# EAGLE schematic top_3-28-21m (EAGLE 9.6.1)
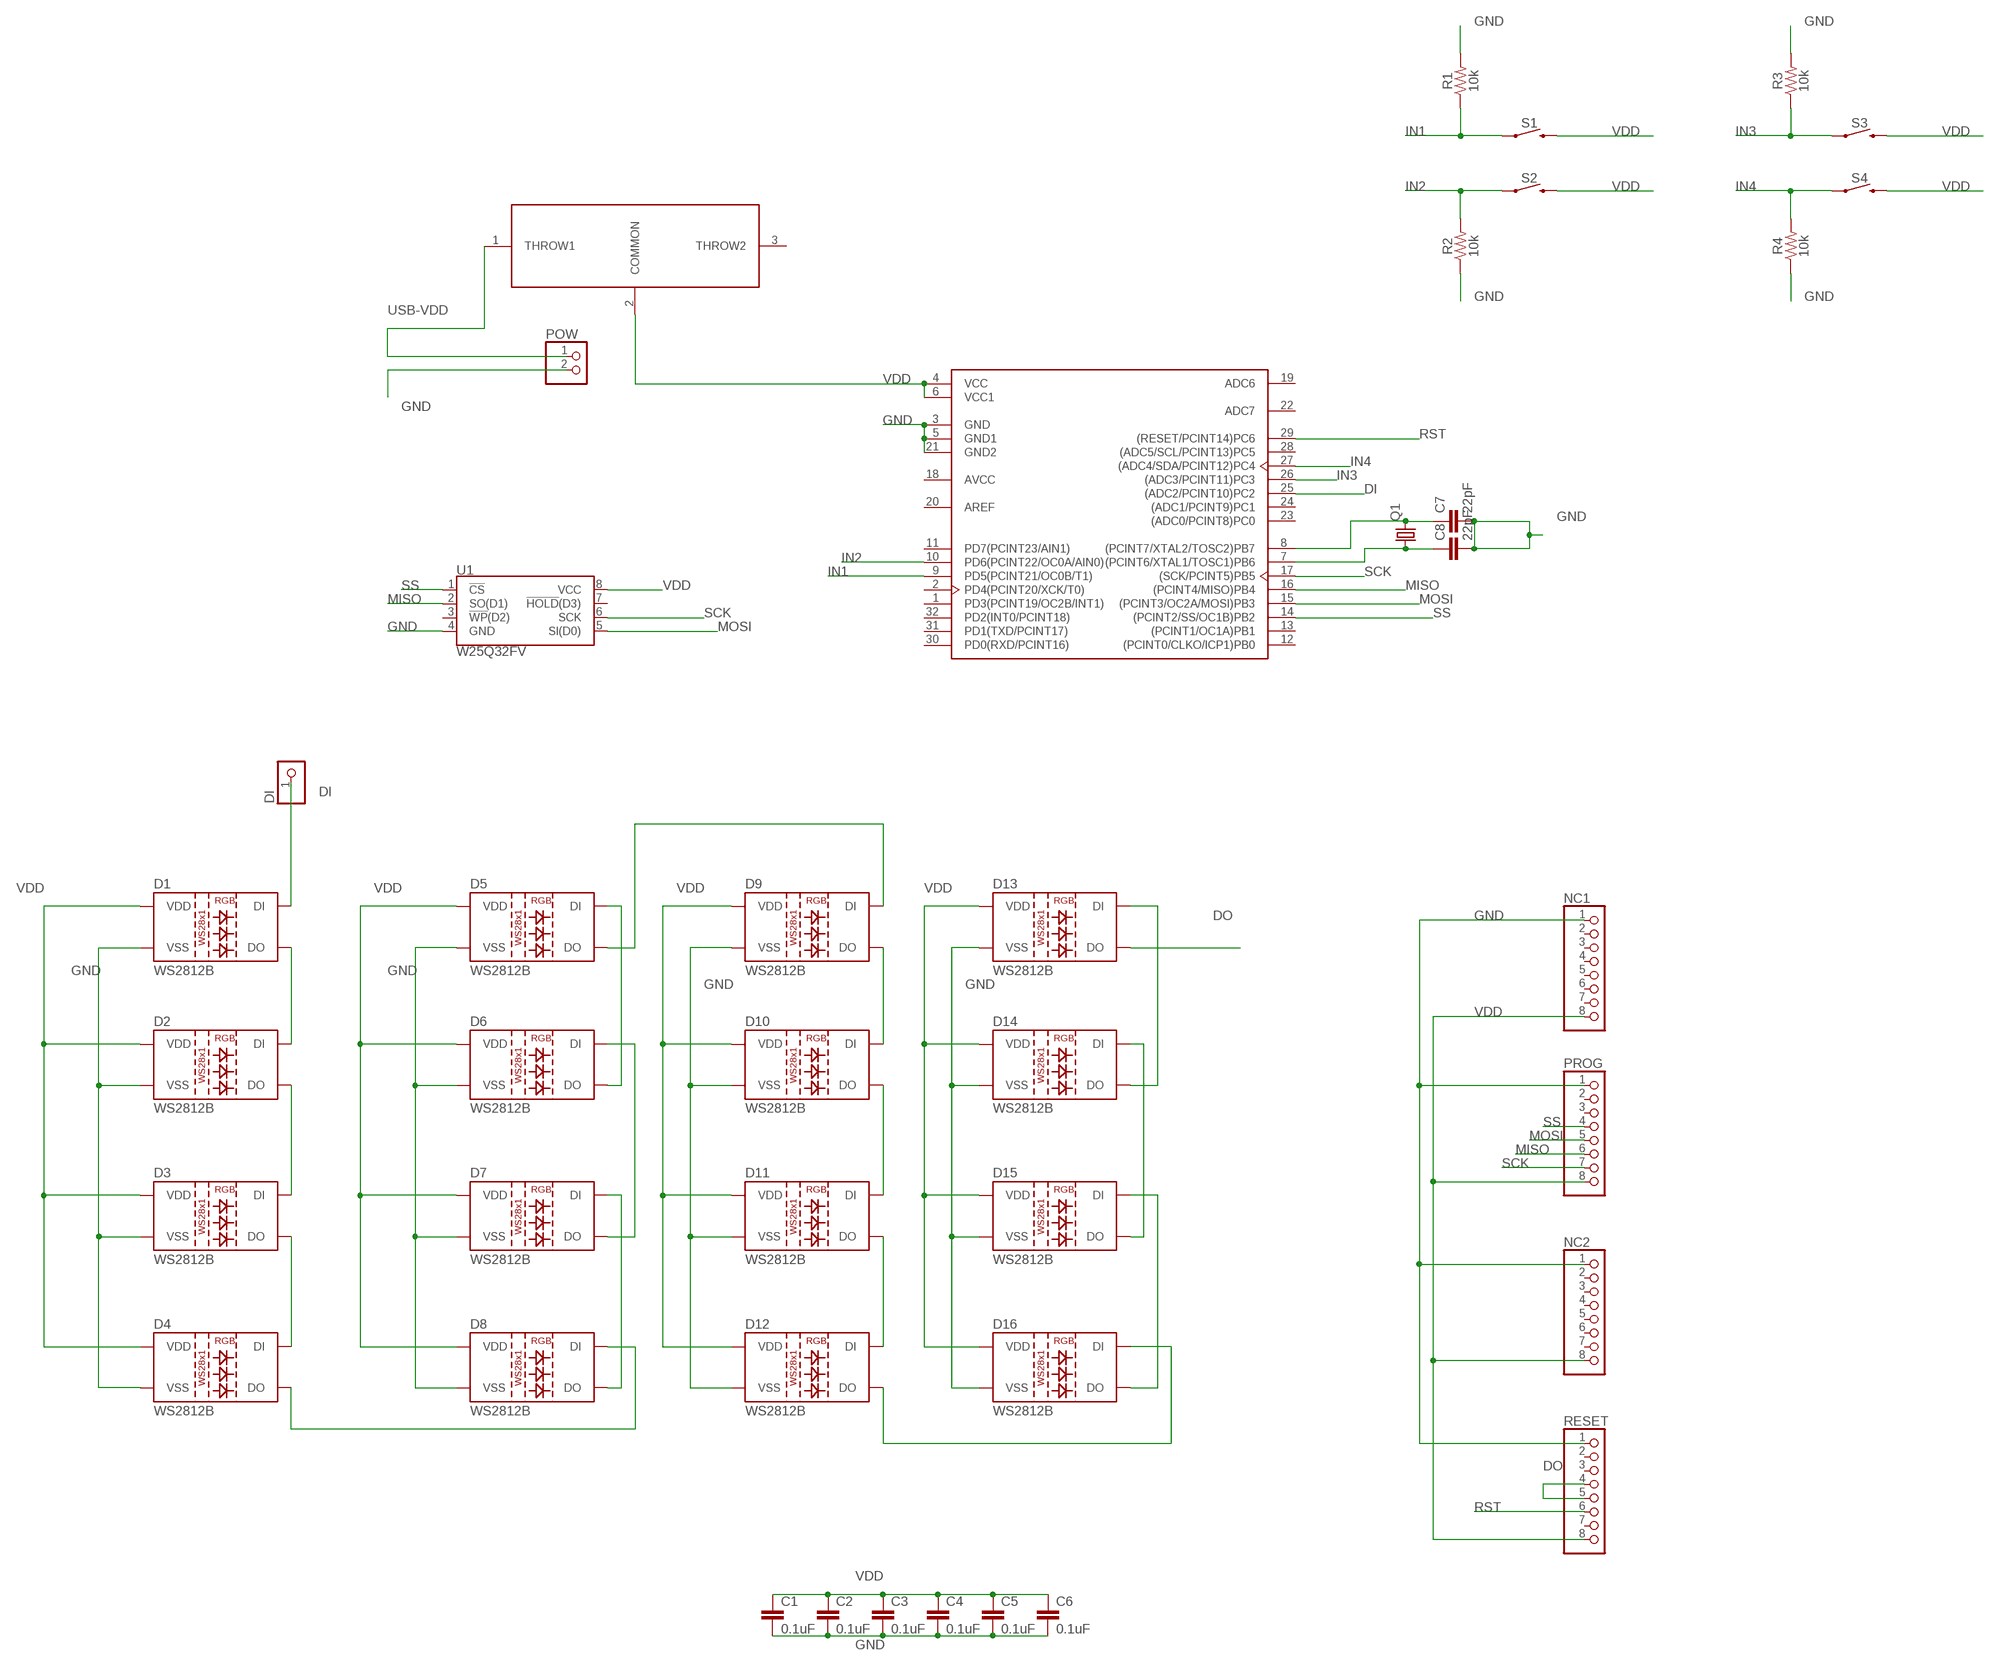
[diagram p0: schematic, sheet 1]

## Parts
C1  0.1uF  0.1UF-0603-25V-5%  [0603]
C2  0.1uF  0.1UF-0603-25V-5%  [0603]
C3  0.1uF  0.1UF-0603-25V-5%  [0603]
C4  0.1uF  0.1UF-0603-25V-5%  [0603]
C5  0.1uF  0.1UF-0603-25V-5%  [0603]
C6  0.1uF  0.1UF-0603-25V-5%  [0603]
C7  22pF  1.0UF-0805-25V-(+80/-20%)  [0805]
C8  22pF  1.0UF-0805-25V-(+80/-20%)  [0805]
D1  WS2812B  [WS2812B]
D2  WS2812B  [WS2812B]
D3  WS2812B  [WS2812B]
D4  WS2812B  [WS2812B]
D5  WS2812B  [WS2812B]
D6  WS2812B  [WS2812B]
D7  WS2812B  [WS2812B]
D8  WS2812B  [WS2812B]
D9  WS2812B  [WS2812B]
D10  WS2812B  [WS2812B]
D11  WS2812B  [WS2812B]
D12  WS2812B  [WS2812B]
D13  WS2812B  [WS2812B]
D14  WS2812B  [WS2812B]
D15  WS2812B  [WS2812B]
D16  WS2812B  [WS2812B]
DI  PINHD-1X1  [1X01]
IC1  ATMEGA328P-AU  [TQFP-32]
NC1  PINHD-1X8  [1X08]
NC2  PINHD-1X8  [1X08]
POW  PINHD-1X2  [1X02]
PROG  PINHD-1X8  [1X08]
Q1  CRYSTALHC49S  [HC49/S]
R1  10k  0.3OHM-0805-1/8W-1%  [0805]
R2  10k  0.3OHM-0805-1/8W-1%  [0805]
R3  10k  0.3OHM-0805-1/8W-1%  [0805]
R4  10k  0.3OHM-0805-1/8W-1%  [0805]
RESET  PINHD-1X8  [1X08]
S1  MOMENTARY-SWITCH-SPST-PTH-6.0MM  [TACTILE_SWITCH_PTH_6.0MM]
S2  MOMENTARY-SWITCH-SPST-PTH-6.0MM  [TACTILE_SWITCH_PTH_6.0MM]
S3  MOMENTARY-SWITCH-SPST-PTH-6.0MM  [TACTILE_SWITCH_PTH_6.0MM]
S4  MOMENTARY-SWITCH-SPST-PTH-6.0MM  [TACTILE_SWITCH_PTH_6.0MM]
U1  W25Q32FV  W25Q32FVSS  [SOIC-8]
U$2  SLIDE_SWITCH_1P2T  [SLIDE_SWITCH_1P2T]

## Nets
DI: D1.4(DI) DI.1 IC1.25((ADC2/PCINT10)PC2)
DO: D13.2(DO) RESET.4 RESET.5
GND: C1.2 C2.2 C3.2 C4.2 C5.2 C6.2 C7.2 C8.2 D1.3(VSS) D2.3(VSS) D3.3(VSS) D4.3(VSS) D5.3(VSS) D6.3(VSS) D7.3(VSS) D8.3(VSS) D9.3(VSS) D10.3(VSS) D11.3(VSS) D12.3(VSS) D13.3(VSS) D14.3(VSS) D15.3(VSS) D16.3(VSS) IC1.3(GND) IC1.5(GND1) IC1.21(GND2) NC1.1 NC2.1 POW.2 PROG.1 R1.2 R2.1 R3.2 R4.1 RESET.1 U1.4(GND)
IN1: IC1.9(PD5(PCINT21/OC0B/T1)) R1.1 S1.1
IN2: IC1.10(PD6(PCINT22/OC0A/AIN0)) R2.2 S2.1
IN3: IC1.26((ADC3/PCINT11)PC3) R3.1 S3.1
IN4: IC1.27((ADC4/SDA/PCINT12)PC4) R4.2 S4.1
MISO: IC1.16((PCINT4/MISO)PB4) PROG.6 U1.2(SO(D1))
MOSI: IC1.15((PCINT3/OC2A/MOSI)PB3) PROG.5 U1.5(SI(D0))
N$1: D4.2(DO) D8.4(DI)
N$2: D7.4(DI) D8.2(DO)
N$3: D1.2(DO) D2.4(DI)
N$4: D2.2(DO) D3.4(DI)
N$5: D3.2(DO) D4.4(DI)
N$6: D6.4(DI) D7.2(DO)
N$7: D5.2(DO) D9.4(DI)
N$8: D12.2(DO) D16.4(DI)
N$9: D15.4(DI) D16.2(DO)
N$10: D9.2(DO) D10.4(DI)
N$11: D10.2(DO) D11.4(DI)
N$12: D11.2(DO) D12.4(DI)
N$13: D14.4(DI) D15.2(DO)
N$14: D13.4(DI) D14.2(DO)
N$15: C7.1 IC1.8((PCINT7/XTAL2/TOSC2)PB7) Q1.2
N$16: D5.4(DI) D6.2(DO)
N$17: C8.1 IC1.7((PCINT6/XTAL1/TOSC1)PB6) Q1.1
RST: IC1.29((RESET/PCINT14)PC6) RESET.6
SCK: IC1.17((SCK/PCINT5)PB5) PROG.7 U1.6(SCK)
SS: IC1.14((PCINT2/SS/OC1B)PB2) PROG.4 U1.1(!CS!)
USB-VDD [pow_width]: POW.1 U$2.1(THROW1)
VDD [pow_width]: C1.1 C2.1 C3.1 C4.1 C5.1 C6.1 D1.1(VDD) D2.1(VDD) D3.1(VDD) D4.1(VDD) D5.1(VDD) D6.1(VDD) D7.1(VDD) D8.1(VDD) D9.1(VDD) D10.1(VDD) D11.1(VDD) D12.1(VDD) D13.1(VDD) D14.1(VDD) D15.1(VDD) D16.1(VDD) IC1.4(VCC) IC1.6(VCC1) NC1.8 NC2.8 PROG.8 RESET.8 S1.3 S2.3 S3.3 S4.3 U1.8(VCC) U$2.2(COMMON)
Unconnected: IC1.1(PD3(PCINT19/OC2B/INT1)) IC1.2(PD4(PCINT20/XCK/T0)) IC1.11(PD7(PCINT23/AIN1)) IC1.12((PCINT0/CLKO/ICP1)PB0) IC1.13((PCINT1/OC1A)PB1) IC1.19(ADC6) IC1.22(ADC7) IC1.23((ADC0/PCINT8)PC0) IC1.24((ADC1/PCINT9)PC1) IC1.28((ADC5/SCL/PCINT13)PC5) IC1.30(PD0(RXD/PCINT16)) IC1.31(PD1(TXD/PCINT17)) IC1.32(PD2(INT0/PCINT18)) NC1.2 NC1.3 NC1.4 NC1.5 NC1.6 NC1.7 NC2.2 NC2.3 NC2.4 NC2.5 NC2.6 NC2.7 PROG.2 PROG.3 RESET.2 RESET.3 RESET.7 U1.3(!WP!(D2)) U1.7(!HOLD!(D3)) U$2.3(THROW2)

## Power pins joined to a net without a drawn wire
AREF: IC1.20(AREF)
AVCC: IC1.18(AVCC)

## Library data of the parts
C1-C6 = SparkFun-Capacitors:0.1UF: 0.1µF ceramic capacitors A capacitor is a passive two-terminal electrical component used to store electrical energy temporarily in an electric field.; PROD_ID: CAP-08604
C7 C8 = SparkFun-Capacitors:1.0UF: 1µF ceramic capacitors A capacitor is a passive two-terminal electrical component used to store electrical energy temporarily in an electric field.; PROD_ID: CAP-11625; VALUE: 1.0uF
D1-D16 = my-LED-cube:WS2812B: WS2812B SMD addressable RGB LED 5x5mm SMD LED with built-in controller IC. Color: Red/Green/Blue mC Rating: RGB: 390, 660, 180 mcd Forward Voltage: RGB: 2.0, 3.0, 3.0 V Packages:WS2812B SparkFun Products: Blynk Board - ESP8266 <https://www.sparkfun.com/products/13794>; PROD_ID: DIO-12503
DI = pinhead:PINHD-1X1: PIN HEADER
IC1 = Microcontroller:ATMEGA328P-AU: IC MCU 8BIT 32KB FLASH 32TQFP Manufacturer's datasheet <http://ww1.microchip.com/downloads/en/DeviceDoc/ATmega48A-PA-88A-PA-168A-PA-328-P-DS-DS40002061A.pdf>; CREATED_BY: PCBLayout.com; DIGIKEY_PART_NUMBER: ATMEGA328P-AU-ND; MANUFACTURER: Microchip Technology; MPN: ATMEGA328P-AU; PACKAGE: TQFP-32
NC1 NC2 PROG RESET = pinhead:PINHD-1X8: PIN HEADER
POW = pinhead:PINHD-1X2: PIN HEADER
Q1 = adafruit:CRYSTAL: CRYSTAL; OC_FARNELL: 1667008; OC_NEWARK: unknown
R1-R4 = SparkFun-Resistors:0.3OHM: 0.3Ω resistor A resistor is a passive two-terminal electrical component that implements electrical resistance as a circuit element. Resistors act to reduce current flow, and, at the same time, act to lower voltage levels within circuits. - Wikipedia; PROD_ID: RES-11622; VALUE: 0.3
S1-S4 = SparkFun-Switches:MOMENTARY-SWITCH-SPST: Momentary Switch (Pushbutton) - SPST Normally-open (NO) SPST momentary switches (buttons, pushbuttons). Variants PTH-12MM - 12mm square, through-hole Momentary Pushbutton Switch - 12mm Square <https://www.sparkfun.com/products/9190> (COM-09190) PTH-6.0MM, PTH-6.0MM-KIT - 6.0mm square, through-hole Mini Pushbutton Switch <https://www.sparkfun.com/products/97> (COM-00097) KIT package intended for soldering kit's - only one side of pads' copper is exposed. PTH-RIGHT-ANGLE-KIT - Right-angle, through-hole Right Angle Tactile Button <https://www.sparkfun.com/products/10791> - Used on SparkFun BigTime Watch Kit <https://www.sparkfun.com/products/11734> SMD-12MM - 12mm square, surface-mount Tactile Button - SMD (12mm) <https://www.sparkfun.com/products/12993> (COM-12993) Used on SparkFun PicoBoard <https://www.sparkfun.com/products/11888> SMD-4.5MM - 4.5mm Square Trackball Switch Used on SparkFun Blackberry Trackballer Breakout <https://www.sparkfun.com/products/13169> SMD-4.6MMX2.8MM - 4.60mm x 2.80mm, surface mount Used on SparkFun SAMD21 Mini Breakout <https://www.sparkfun.com/products/13664> SMD-5.2MM, SMD-5.2-REDUNDANT - 5.2mm square, surface-mount Mini Pushbutton Switch - SMD <https://www.sparkfun.com/products/8720> (COM-08720) Used on Arduino Pro Mini <https://www.sparkfun.com/products/11114> REDUNDANT package connects both switch circuits together SMD-6.0X3.5MM - 6.0 x 3.5mm, surface mount Momentary Reset Switch SMD <https://www.sparkfun.com/products/8229> (COM-08229) SMD-6.2MM-TALL - 6.2mm square, surface mount Tactile Button - SMD (6mm) <https://www.sparkfun.com/products/12992> Used on SparkFun Digital Sandbox <https://www.sparkfun.com/products/12651> SMD-RIGHT-ANGLE - Right-angle, surface mount Used on SparkFun Block for Intel® Edison - Arduino <https://www.sparkfun.com/products/13036>; PROD_ID: SWCH-08441; SF_SKU: COM-00097
U1 = SparkFun-IC-Memory:W25Q32FV: W25Q32FV 32Mb (4MB) Serial Flash Memory The W25Q32FV support the standard Serial Peripheral Interface (SPI), Dual/Quad I/O SPI as well as 2-clocks instruction cycle Quad Peripheral Interface (QPI). 104MHz, SPI, 8-SOIC-EIAJ Datasheet <http://www.winbond.com/resource-files/w25q32fv%20revh%20091613.pdf> SparkFun Products SparkFun Blynk Board - ESP8266 <https://www.sparkfun.com/products/13794> (WRL-13794); PROD_ID: IC-13229
U$2 = metronome:SLIDE_SWITCH_1P2T

## Net classes
1 pow_width: width 0.102 mm